# Altium schematic sheet Clock_Distribution.SchDoc
size 420 x 297 mm; DocumentNumber: 2; SheetNumber: 2; SheetTotal: 8; EDA_Number: ARTIQ; ModifiedBy: -; Title2: -; DivGrp: ISE; ModifiedDate: -
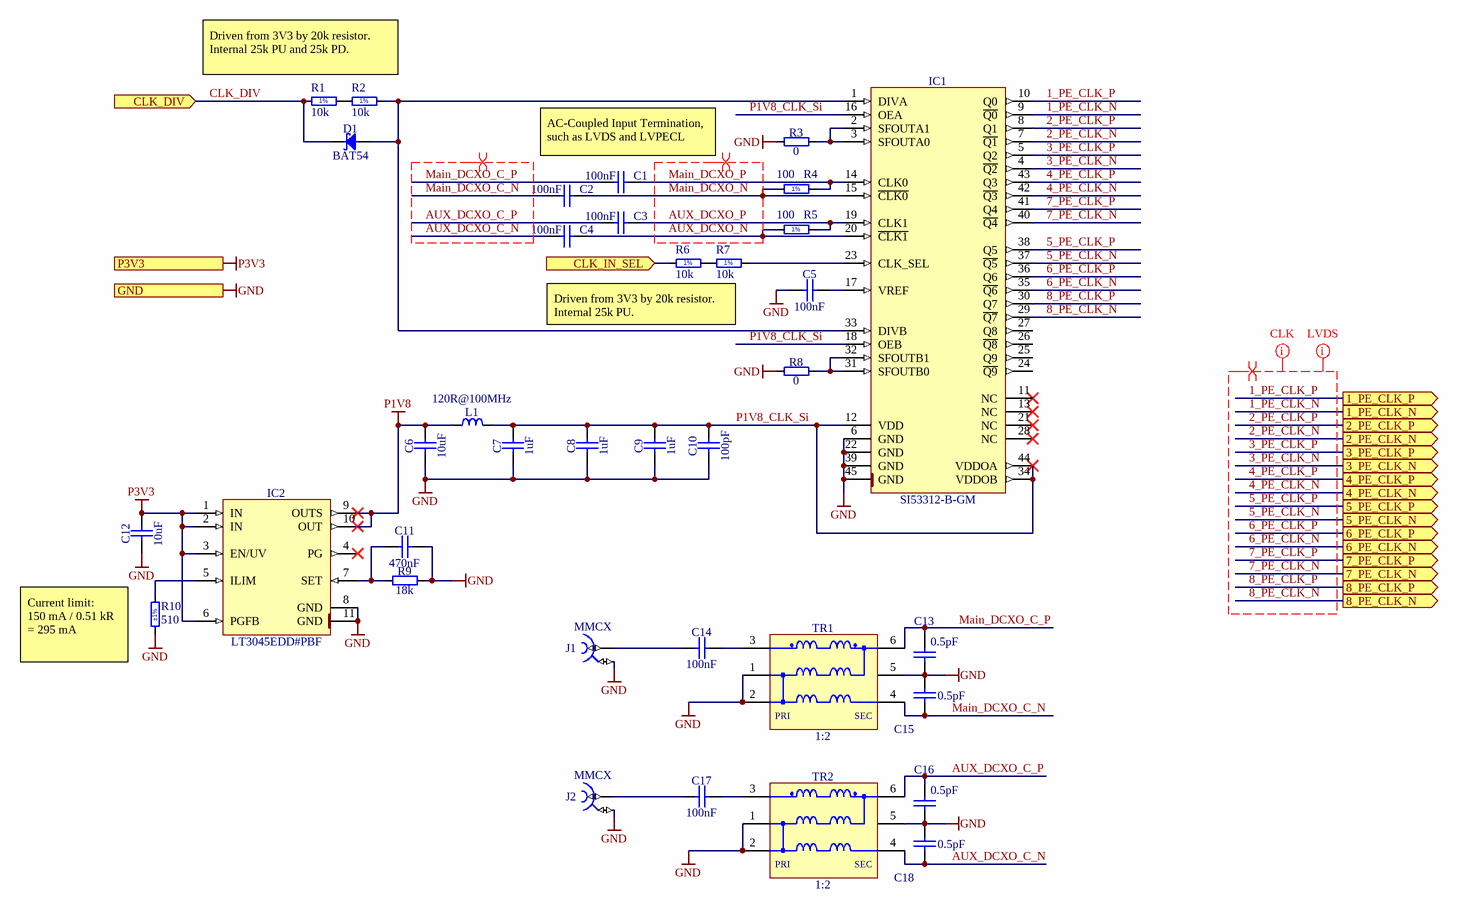
[diagram p0: Clock_Distribution.SchDoc]

## Parts
C1  100nF  [CAPC0603X33N]
C2  100nF  [CAPC0603X33N]
C3  100nF  [CAPC0603X33N]
C4  100nF  [CAPC0603X33N]
C5  100nF  [CAPC1005X55N]
C6  10uF  [CAPC1608X80N]
C7  1uF  [CAPC1608X87N]
C8  1uF  [CAPC1608X87N]
C9  1uF  [CAPC1608X87N]
C10  100pF  [CAPC1005X55N]
C11  470nF  [CAPC1005X55N]
C12  10uF  [CAPC1608X80N]
C13  0.5pF  [CAPC1005X50N]
C14  100nF  [CAPC1005X55N]
C15  0.5pF  [CAPC1005X50N]
C16  0.5pF  [CAPC1005X50N]
C17  100nF  [CAPC1005X55N]
C18  0.5pF  [CAPC1005X50N]
D1  BAT54  [SOT95P240X130-3N]
IC1  SI53312-B-GM  [QFN50P700X700X90-45N-S295]
IC2  LT3045EDD#PBF  [SON50P300X300X80-11N-R175X248]
J1  Family: MMCX  [HUBER-SUHNER_85_MMCX-50-0-1/111_OE]  (hidden comment: Coax_1Female_1Shield)
J2  Family: MMCX  [HUBER-SUHNER_85_MMCX-50-0-1/111_OE]  (hidden comment: Coax_1Female_1Shield)
L1  120R@100MHz  [INDC1608X95N]
R1  10k  [RESC1005X40N]
R2  10k  [RESC1005X40N]
R3  0  [RESC0603X28N]
R4  100  [RESC1005X40N]
R5  100  [RESC1005X40N]
R6  10k  [RESC1005X40N]
R7  10k  [RESC1005X40N]
R8  0  [RESC0603X28N]
R9  18k  [RESC1005X40N]
R10  510  Tolerance: ±1%  [RESC1005X40N]
TR1  1:2  [XFMR_MINI-CIRCUITS_DB1627]
TR2  1:2  [XFMR_MINI-CIRCUITS_DB1627]

## Ports
1_PE_CLK_N (out), 1_PE_CLK_P (out), 2_PE_CLK_N (out), 2_PE_CLK_P (out), 3_PE_CLK_N (out), 3_PE_CLK_P (out), 4_PE_CLK_N (out), 4_PE_CLK_P (out), 5_PE_CLK_N (out), 5_PE_CLK_P (out), 6_PE_CLK_N (out), 6_PE_CLK_P (out), 7_PE_CLK_N (out), 7_PE_CLK_P (out), 8_PE_CLK_N (out), 8_PE_CLK_P (out), CLK_DIV (in), CLK_IN_SEL (in), GND, P3V3 (in)

## Nets
GND: C5.1 C6.1 C7.1 C8.1 C9.1 C10.1 C11.2 C12.1 C13.1 C15.2 C16.1 C18.2 IC1.6(GND) IC1.22(GND) IC1.39(GND) IC1.45(GND) IC2.8(GND) IC2.11(GND) J1.2 J2.2 R3.1 R8.1 R9.2 R10.1 TR1.1(P1) TR1.2(P1) TR1.5(NC) TR2.1(P1) TR2.2(P1) TR2.5(NC) ; port GND
P1V8: C6.2 IC2.9(OUTS) IC2.10(OUT) L1.2
P3V3: C12.2 IC2.1(IN) IC2.2(IN) IC2.3(EN/UV) IC2.6(PGFB) ; port P3V3
1_PE_CLK_N: IC1.9(~{Q0}) ; port 1_PE_CLK_N
1_PE_CLK_P: IC1.10(Q0) ; port 1_PE_CLK_P
2_PE_CLK_N: IC1.7(~{Q1}) ; port 2_PE_CLK_N
2_PE_CLK_P: IC1.8(Q1) ; port 2_PE_CLK_P
3_PE_CLK_N: IC1.4(~{Q2}) ; port 3_PE_CLK_N
3_PE_CLK_P: IC1.5(Q2) ; port 3_PE_CLK_P
4_PE_CLK_N: IC1.42(~{Q3}) ; port 4_PE_CLK_N
4_PE_CLK_P: IC1.43(Q3) ; port 4_PE_CLK_P
5_PE_CLK_N: IC1.37(~{Q5}) ; port 5_PE_CLK_N
5_PE_CLK_P: IC1.38(Q5) ; port 5_PE_CLK_P
6_PE_CLK_N: IC1.35(~{Q6}) ; port 6_PE_CLK_N
6_PE_CLK_P: IC1.36(Q6) ; port 6_PE_CLK_P
7_PE_CLK_N: IC1.40(~{Q4}) ; port 7_PE_CLK_N
7_PE_CLK_P: IC1.41(Q4) ; port 7_PE_CLK_P
8_PE_CLK_N: IC1.29(~{Q7}) ; port 8_PE_CLK_N
8_PE_CLK_P: IC1.30(Q7) ; port 8_PE_CLK_P
AUX_DCXO_C_N: C4.1 C18.1 TR2.4(S1)
AUX_DCXO_C_P: C3.1 C16.2 TR2.6(S1)
AUX_DCXO_N: C4.2 IC1.20(~{CLK1}) R5.1
AUX_DCXO_P: C3.2 IC1.19(CLK1) R5.2
CLK_DIV: D1.3(C) R1.1 ; port CLK_DIV
CLK_IN_SEL: R6.1 ; port CLK_IN_SEL
Main_DCXO_C_N: C2.1 C15.1 TR1.4(S1)
Main_DCXO_C_P: C1.1 C13.2 TR1.6(S1)
Main_DCXO_N: C2.2 IC1.15(~{CLK0}) R4.1
Main_DCXO_P: C1.2 IC1.14(CLK0) R4.2
P1V8_CLK_Si: C7.2 C8.2 C9.2 C10.2 IC1.12(VDD) IC1.16(OEA) IC1.18(OEB) IC1.34(VDDOB) IC1.44(VDDOA) L1.1
NetC5_2: C5.2 IC1.17(VREF)
NetC11_1: C11.1 IC2.7(SET) R9.1
NetC14_1: C14.1 J1.1
NetC14_2: C14.2 TR1.3(P1)
NetC17_1: C17.1 J2.1
NetC17_2: C17.2 TR2.3(P1)
NetD1_1: D1.1(A) IC1.1(DIVA) IC1.33(DIVB) R2.2
NetIC1_2: IC1.2(SFOUTA1) IC1.3(SFOUTA0) R3.2
NetIC1_23: IC1.23(CLK_SEL) R7.2
NetIC1_31: IC1.31(SFOUTB0) IC1.32(SFOUTB1) R8.2
NetIC2_5: IC2.5(ILIM) R10.2
NetR1_2: R1.2 R2.1
NetR6_2: R6.2 R7.1

Not connected (* = marked no-connect by the designer): IC1 11(NC)* 13(NC)* 21(NC)* 24(~{Q9}) 25(Q9) 26(~{Q8}) 27(Q8) 28(NC)*; IC2 4(PG)*

## Layout directives
net class LVDS: 1_PE_CLK_N, 1_PE_CLK_P, 2_PE_CLK_N, 2_PE_CLK_P, 3_PE_CLK_N, 3_PE_CLK_P, 4_PE_CLK_N, 4_PE_CLK_P, 5_PE_CLK_N, 5_PE_CLK_P, 6_PE_CLK_N, 6_PE_CLK_P, 7_PE_CLK_N, 7_PE_CLK_P, 8_PE_CLK_N, 8_PE_CLK_P
net class CLK: 1_PE_CLK_N, 1_PE_CLK_P, 2_PE_CLK_N, 2_PE_CLK_P, 3_PE_CLK_N, 3_PE_CLK_P, 4_PE_CLK_N, 4_PE_CLK_P, 5_PE_CLK_N, 5_PE_CLK_P, 6_PE_CLK_N, 6_PE_CLK_P, 7_PE_CLK_N, 7_PE_CLK_P, 8_PE_CLK_N, 8_PE_CLK_P
differential pair: 1_PE_CLK_N, 1_PE_CLK_P, 2_PE_CLK_N, 2_PE_CLK_P, 3_PE_CLK_N, 3_PE_CLK_P, 4_PE_CLK_N, 4_PE_CLK_P, 5_PE_CLK_N, 5_PE_CLK_P, 6_PE_CLK_N, 6_PE_CLK_P, 7_PE_CLK_N, 7_PE_CLK_P, 8_PE_CLK_N, 8_PE_CLK_P, AUX_DCXO_C_N, AUX_DCXO_C_P, AUX_DCXO_N, AUX_DCXO_P, Main_DCXO_C_N, Main_DCXO_C_P, Main_DCXO_N, Main_DCXO_P

## Notes on the sheet
- Driven from 3V3 by 20k resistor.
  Internal 25k PU and 25k PD.
- AC-Coupled Input Termination, such as LVDS and LVPECL
- Driven from 3V3 by 20k resistor. Internal 25k PU.
- (near R10) Current limit:
  150 mA / 0.51 kR
  = 295 mA
- Project/Equipment
- Document
- Designer
- Drawn by
- Check.by
- Copyright WUT 2023.
  This document describes Open Hardware and is licensed under the CERN-OHL-W v2
  You may redistribute and modify this documentation and make products using it under the terms of the CERN-OHL-W v2 (https:/cern.ch/cern-ohl). This documentation is distributed WITHOUT ANY EXPRESS OR IMPLIED WARRANTY, INCLUDING OF MERCHANTABILITY, SATISFACTORY QUALITY AND FITNESS FOR A PARTICULAR PURPOSE. Please see the CERN-OHL-W v2 for applicable conditions.
  Source location: https://github.com/sinara-hw/EEM_FMC_Carrier
  As per CERN-OHL-W v2 section 4, should You produce hardware based on these sources, You must maintain the Source Location visible on the silkscreen or top copper for a EEM FMC Carrier PCB or other product you make using this documentation.
- Contact:
- File
- Last Mod.
- Print Date
- Sheet
- Size
- A3
- of
- Rev
- (in symbol R0402_10K_1%_0.0625W_100PPM) 1%
- (in symbol R0402_100R_1%_0.0625W_100PPM) 1%
- (in symbol XFMR_MINI-CIRCUITS_TCM2-43X+) PRI; SEC

## Library data of the parts
C1-C4 = CC0201_100NF_6.3V_10%_X5R: Non-polarised capacitor; Part Description: SMD Multilayer Chip Ceramic Capacitor; Manufacturer: GENERIC; Manufacturer1 Part Number: 02016D104KAT2A; Voltage: 6.3V; TC: X5R; Tolerance: ±10%; Part Number: CC0201_100NF_6.3V_10%_X5R; Component Kind: Standard; Component Type: Standard; Pin Count: 2; Value: 100nF; Status: Not Recommended; Manufacturer Part Number: CC0201_100NF_6.3V_10%_X5R; Case: 0201; Mounted: Yes; Socket: No; SMD: Yes; Sense: No; Manufacturer1 Example: AVX; Manufacturer1 ComponentHeight: 0.33mm; HelpURL: \\cern.ch\dfs\Applications\Altium\Datasheets\CC0201_X5R_AVX.pdf; Author: CERN DEM JLC; CreateDate: 03.12.2007; LatestRevisionDate: 03.12.2007
C5 C14 C17 = CC0402_100NF_16V_10%_X7R: Non-polarised capacitor; Part Description: SMD Multilayer Chip Ceramic Capacitor; Manufacturer: GENERIC; Manufacturer1 Part Number: GRM155R71C104KA88D; Voltage: 16V; TC: X7R; Tolerance: ±10%; Part Number: CC0402_100NF_16V_10%_X7R; Component Kind: Standard; Component Type: Standard; Pin Count: 2; Value: 100nF; Status: Not Recommended; Manufacturer Part Number: CC0402_100NF_16V_10%_X7R; Case: 0402; Mounted: Yes; Socket: No; SMD: Yes; Sense: No; Manufacturer1 Example: MURATA; Manufacturer1 ComponentHeight: 0.55mm; HelpURL: \\cern.ch\dfs\Applications\Altium\Datasheets\CC0402_X7R_MURATA_GRM.pdf; Author: CERN DEM JLC; CreateDate: 05.12.2013; LatestRevisionDate: 03.12.2007
C6 C12 = CC0603_10UF_10V_10%_X5R: Non-polarised capacitor; Part Description: SMD Multilayer Chip Ceramic Capacitor; Manufacturer: GENERIC; Manufacturer1 Part Number: GRM188R61A106KE69D; Voltage: 10V; TC: X5R; Tolerance: ±10%; Part Number: CC0603_10UF_10V_10%_X5R; Component Kind: Standard; Component Type: Standard; Pin Count: 2; Value: 10uF; Status: None; Manufacturer Part Number: CC0603_10UF_10V_10%_X5R; Case: 0603; Mounted: Yes; Socket: No; SMD: Yes; Sense: No; Manufacturer1 Example: MURATA; Manufacturer1 ComponentHeight: 0.8mm; HelpURL: \\cern.ch\dfs\Applications\Altium\Datasheets\CC0603_MURATA_GRM188R61A106KE69D.pdf; Author: CERN DEM JLC; CreateDate: 31.01.2017; LatestRevisionDate: 31.01.2017
C7-C9 = CC0603_1UF_25V_10%_X7R: Non-polarised capacitor; Part Description: SMD Multilayer Chip Ceramic Capacitor; Manufacturer: GENERIC; Manufacturer1 Part Number: GRM188R71E105KA12D; Voltage: 25V; TC: X7R; Tolerance: ±10%; Part Number: CC0603_1UF_25V_10%_X7R; Component Kind: Standard; Component Type: Standard; Pin Count: 2; Value: 1uF; Status: None; Manufacturer Part Number: CC0603_1UF_25V_10%_X7R; Case: 0603; Mounted: Yes; Socket: No; SMD: Yes; Sense: No; Manufacturer1 Example: MURATA; Manufacturer1 ComponentHeight: 0.9mm; HelpURL: \\cern.ch\dfs\Applications\Altium\Datasheets\CC0603_X7R_MURATA.pdf; Author: CERN DEM JLC; CreateDate: 18.01.2011; LatestRevisionDate: 18.01.2011
C10 = CC0402_100PF_50V_5%_C0G: Non-polarised capacitor; Part Description: SMD Multilayer Chip Ceramic Capacitor; Manufacturer: GENERIC; Manufacturer1 Part Number: C0402C101J5GACTU; Voltage: 50V; TC: C0G/NP0; Tolerance: ±5%; Part Number: CC0402_100PF_50V_5%_C0G; Component Kind: Standard; Component Type: Standard; Pin Count: 2; Value: 100pF; Status: Preferred; Manufacturer Part Number: CC0402_100PF_50V_5%_C0G; Case: 0402; Mounted: Yes; Socket: No; SMD: Yes; Sense: No; Manufacturer1 Example: KEMET; Manufacturer1 ComponentHeight: 0.55mm; HelpURL: \\cern.ch\dfs\Applications\Altium\Datasheets\CC0805_C0G_KEMET_(Commercial Grade).pdf; Author: CERN DEM JLC; CreateDate: 03.12.2007; LatestRevisionDate: 22.04.2015
C11 = CC0402_470NF_16V_10%_X5R: Non-polarised capacitor; Part Description: SMD Multilayer Chip Ceramic Capacitor; Manufacturer: GENERIC; Manufacturer1 Part Number: C1005X5R1C105KT; Voltage: 16V; TC: X5R; Tolerance: ±10%; Part Number: CC0402_470NF_16V_10%_X5R; Component Kind: Standard; Component Type: Standard; Pin Count: 2; Value: 470nF; Status: Preferred; Manufacturer Part Number: CC0402_470NF_16V_10%_X5R; Case: 0402; Mounted: Yes; Socket: No; SMD: Yes; Sense: No; Manufacturer1 Example: TDK; Manufacturer1 ComponentHeight: 0.55mm; HelpURL: \\cern.ch\dfs\Applications\Altium\Datasheets\CC0402_X5R_TDK_C.pdf; Author: CERN DEM JLC; CreateDate: 25.10.2012; LatestRevisionDate: 25.10.2012
C13 C15 C16 C18 = CC0402_0.5PF_25V_0.05PF_AVX_04023J0R5ABSTR: Non-polarised capacitor; Part Description: Thin-Film Chip Capacitors for RF Signal and Power Applications, Accu-P Series; Manufacturer: AVX; Voltage: 25V; Tolerance: ±0.05pF; Part Number: CC0402_0.5PF_25V_0.05PF_AVX_04023J0R5ABSTR; Component Kind: Standard; Component Type: Standard; Pin Count: 2; Value: 0.5pF; Status: None; Manufacturer Part Number: 04023J0R5ABSTR; Case: 0402; Mounted: Yes; Socket: No; SMD: Yes; Sense: No; ComponentHeight: 0.5mm; HelpURL: \\cern.ch\dfs\Applications\Altium\Datasheets\CC0402_AVX_ACCU-P.pdf; Author: CERN DEM JLC; CreateDate: 2017-02-22; LatestRevisionDate: 2017-02-22
D1 = BAT54: Diode Schottky  Anode Pin 1 Cathode Pin 3 (Pas de pin 2); Part Description: Single Small Signal Schottky Diode; Manufacturer: FAIRCHILD SEMICONDUCTOR; Voltage: 30V; Power: 200mA; PressFit: No; Bonding: No; Part Number: BAT54; Component Kind: Standard; Component Type: Standard; Device: BAT54; PackageDescription: SOT, 0.95mm Pitch; 3 Pin, 1.30mm W X 2.90mm L X 1.30mm H body, IPC Medium Density; Manufacturer Part Number: BAT54; Pin Count: 3; Case: SOT23-3; Mounted: Yes; Socket: No; SMD: Yes; Sense: No; ComponentHeight: 1.30mm; HelpURL: \\cern.ch\dfs\Applications\Altium\Datasheets\BAT54.pdf; Author: CERN DEM JLC; CreateDate: 17.09.2009; LatestRevisionDate: 27.05.2010
IC1 = SI53312-B-GM: 2 Input/10 Output, Low Jitter Universal Buffer/Level Translator With 2:1 Input Mux (<1.25 GHZ); Manufacturer: SILICON LABS; PressFit: No; Bonding: No; Part Number: SI53312-B-GM; Component Kind: Standard; Component Type: Standard; Device: SI53312-B-GM; PackageDescription: QFN, 0.50mm Pitch, Square; 44 Pin, 7.00mm L X 7.00mm W X 0.90mm H body (w/Thermal Tab 2.95 X 2.95mm), IPC Medium Density; Part Description: 2 Input/10 Output, Low Jitter Universal Buffer/Level Translator With 2:1 Input Mux (<1.25 GHZ); Manufacturer Part Number: SI53312-B-GM; Pin Count: 45; Case: QFN44; Mounted: Yes; Socket: No; SMD: Yes; Sense: No; ComponentHeight: 0.9mm; Author: CERN DEM MR; HelpURL: \\cern.ch\dfs\Applications\Altium\Datasheets\SI53312-B-GM.pdf; CreateDate: 02.10.2017; LatestRevisionDate: 02.10.2017
IC2 = LT3045EDD#PBF: 20V, 500mA, Ultralow Noise, Ultrahigh PSRR Linear Regulator; Manufacturer: LINEAR TECHNOLOGY; PressFit: No; Bonding: No; Part Number: LT3045EDD#PBF; Component Kind: Standard; Component Type: Standard; Device: LT3045EDD#PBF; PackageDescription: SON, 0.50mm Pitch; 10-pin, 3.00mm W  X 3.00mm L X 0.80mm H Body, (w/thermal tab 1.75 X 2.48 mm), IPC Medium Density; Part Description: 20V, 500mA, Ultralow Noise, Ultrahigh PSRR Linear Regulator; Manufacturer Part Number: LT3045EDD#PBF; Pin Count: 11; Case: SON10; Mounted: Yes; Socket: No; SMD: Yes; Sense: No; ComponentHeight: 0.8mm; HelpURL: \\cern.ch\dfs\Applications\Altium\Datasheets\LT3045EDD#PBF.pdf; Author: CERN DEM JLC; CreateDate: 07.12.2016; LatestRevisionDate: 07.12.2016
J1 J2 = HUBER-SUHNER_85_MMCX-50-0-1/111_OE: Part Description: MMCX 50 Ohms Right Angle PCB Jack; Manufacturer: HUBER+SUHNER; PressFit: No; Part Number: HUBER-SUHNER_85_MMCX-50-0-1/111_OE; Component Kind: Standard; Component Type: Standard; Pin Count: 2; Mounted: Yes; Socket: No; SMD: No; Sense: No; Status: None; Manufacturer Part Number: 85_MMCX-50-0-1/111_OE; ComponentHeight: 9.6mm; HelpURL: \\cern.ch\dfs\Applications\Altium\Datasheets\HUBER-SUHNER_85_MMCX-50-0-1-111_OE.pdf; Author: CERN DEM JLC; CreateDate: 06.11.2014; LatestRevisionDate: 06.11.2014
L1 = IND0603_MURATA_BLM18PG121SN1D: Inductor; Part Description: SMD EMIFIL Chip Ferrite Bead; Manufacturer: MURATA; Power: 2A; Resistance: 0.05R; Part Number: IND0603_MURATA_BLM18PG121SN1D; Component Kind: Standard; Component Type: Standard; Pin Count: 2; Value: 120R@100MHz; Status: None; Manufacturer Part Number: BLM18PG121SN1D; Case: 0603; Mounted: Yes; Socket: No; SMD: Yes; Sense: No; ComponentHeight: 0.95mm; HelpURL: \\cern.ch\dfs\Applications\Altium\Datasheets\IND0603_MURATA_BLM18P.pdf; Author: CERN DEM BC; CreateDate: 2015-07-27; LatestRevisionDate: 2015-07-27
R1 R2 R6 R7 = R0402_10K_1%_0.0625W_100PPM: Resistor - 1%; Part Description: General Purpose Thick Film Chip Resistor; Manufacturer: GENERIC; Manufacturer1 Part Number: 232270671003L; TC: ±100ppm/°C; Part Number: R0402_10K_1%_0.0625W_100PPM; Component Kind: Standard; Component Type: Standard; Pin Count: 2; Value: 10k; Status: Not recommended; Power: 0.0625W; Tolerance: ±1%; Manufacturer Part Number: R0402_10K_1%_0.0625W_100PPM; Case: 0402; Mounted: Yes; Sense: No; Socket: No; SMD: Yes; Manufacturer1 Example: YAGEO PHYCOMP; Manufacturer1 ComponentHeight: 0.4mm; HelpURL: \\cern.ch\dfs\Applications\Altium\Datasheets\R0402_Phycomp_RC0402.pdf; Author: CERN DEM JLC; CreateDate: 03.12.2007; LatestRevisionDate: 17.10.2012
R3 R8 = R0201_0R_JUMPER: Resistor; Part Description: 1A (0.05R Max DC Resistance) Zero Ohm Jumper; Manufacturer: GENERIC; Manufacturer1 Part Number: CRCW02010000Z0ED; PressFit: No; Part Number: R0201_0R_JUMPER; Component Kind: Standard; Component Type: Standard; Pin Count: 2; Value: 0; Status: Not Recommended; Manufacturer Part Number: R0201_0R_JUMPER; Case: 0201; Mounted: Yes; Sense: No; Socket: No; SMD: Yes; Manufacturer1 Example: VISHAY; Manufacturer1 ComponentHeight: 0.27mm; HelpURL: \\cern.ch\dfs\Applications\Altium\Datasheets\R0201_VISHAY_CRCW e3.pdf; Author: CERN DEM JLC; CreateDate: 19.11.2014; LatestRevisionDate: 08.01.2015
R4 R5 = R0402_100R_1%_0.0625W_100PPM: Resistor - 1%; Part Description: General Purpose Thick Film Chip Resistor; Manufacturer: GENERIC; Manufacturer1 Part Number: 232270671001L; TC: ±100ppm/°C; PressFit: No; Part Number: R0402_100R_1%_0.0625W_100PPM; Component Kind: Standard; Component Type: Standard; Pin Count: 2; Value: 100; Status: Not Recommended; Power: 0.0625W; Tolerance: ±1%; Manufacturer Part Number: R0402_100R_1%_0.0625W_100PPM; Case: 0402; Mounted: Yes; Sense: No; Socket: No; SMD: Yes; Manufacturer1 Example: YAGEO PHYCOMP; Manufacturer1 ComponentHeight: 0.4mm; HelpURL: \\cern.ch\dfs\Applications\Altium\Datasheets\R0402_Phycomp_RC0402.pdf; Author: CERN DEM JLC; CreateDate: 03.12.2007; LatestRevisionDate: 17.10.2012
R9 = R0402_18K_1%_0.0625W_100PPM: Resistor - 1%; Part Description: General Purpose Thick Film Chip Resistor; Manufacturer: GENERIC; Manufacturer1 Part Number: 232270671803L; TC: ±100ppm/°C; PressFit: No; Part Number: R0402_18K_1%_0.0625W_100PPM; Component Kind: Standard; Component Type: Standard; Pin Count: 2; Value: 18k; Status: Not Recommended; Power: 0.0625W; Tolerance: ±1%; Manufacturer Part Number: R0402_18K_1%_0.0625W_100PPM; Case: 0402; Mounted: Yes; Sense: No; Socket: No; SMD: Yes; Manufacturer1 Example: YAGEO PHYCOMP; Manufacturer1 ComponentHeight: 0.4mm; HelpURL: \\cern.ch\dfs\Applications\Altium\Datasheets\R0402_Phycomp_RC0402.pdf; Author: CERN DEM JLC; CreateDate: 03.12.2007; LatestRevisionDate: 17.10.2012
R10 = R0402_510R_1%_0.0625W_100PPM: Resistor - 1%; Part Description: General Purpose Thick Film Chip Resistor; Manufacturer: GENERIC; Manufacturer1 Part Number: 232270675101L; TC: ±100ppm/°C; PressFit: No; Part Number: R0402_510R_1%_0.0625W_100PPM; Component Kind: Standard; Component Type: Standard; Pin Count: 2; Value: 510; Status: Not Recommended; Power: 0.0625W; Manufacturer Part Number: R0402_510R_1%_0.0625W_100PPM; Case: 0402; Mounted: Yes; Sense: No; Socket: No; SMD: Yes; Manufacturer1 Example: YAGEO PHYCOMP; Manufacturer1 ComponentHeight: 0.4mm; HelpURL: \\cern.ch\dfs\Applications\Altium\Datasheets\R0402_Phycomp_RC0402.pdf; Author: CERN DEM JLC; CreateDate: 03.12.2007; LatestRevisionDate: 17.10.2012
TR1 TR2 = XFMR_MINI-CIRCUITS_TCM2-43X+: 50 OHMS 10 to 4000 MHz RF Transformer; Power: 0.4W; Part Number: XFMR_MINI-CIRCUITS_TCM2-43X+; Component Kind: Standard; Component Type: Standard; Pin Count: 6; Value: 1:2; Status: None; Part Description: 50 Ohms 10 to 4000MHz RF Transformer; Manufacturer: MINI-CIRCUITS; Manufacturer Part Number: TCM2-43X+; Mounted: Yes; Socket: No; Sense: No; SMD: Yes; ComponentHeight: 4.06mm; HelpURL: \\cern.ch\dfs\Applications\Altium\Datasheets\XFMR_MINI-CIRCUITS_TCM2-43X+.pdf; Author: CERN DEM BC; CreateDate: 2016-02-12; LatestRevisionDate: 2016-02-12